# Altium project ife18_TS_BMS_Master_STM32.PrjPcb
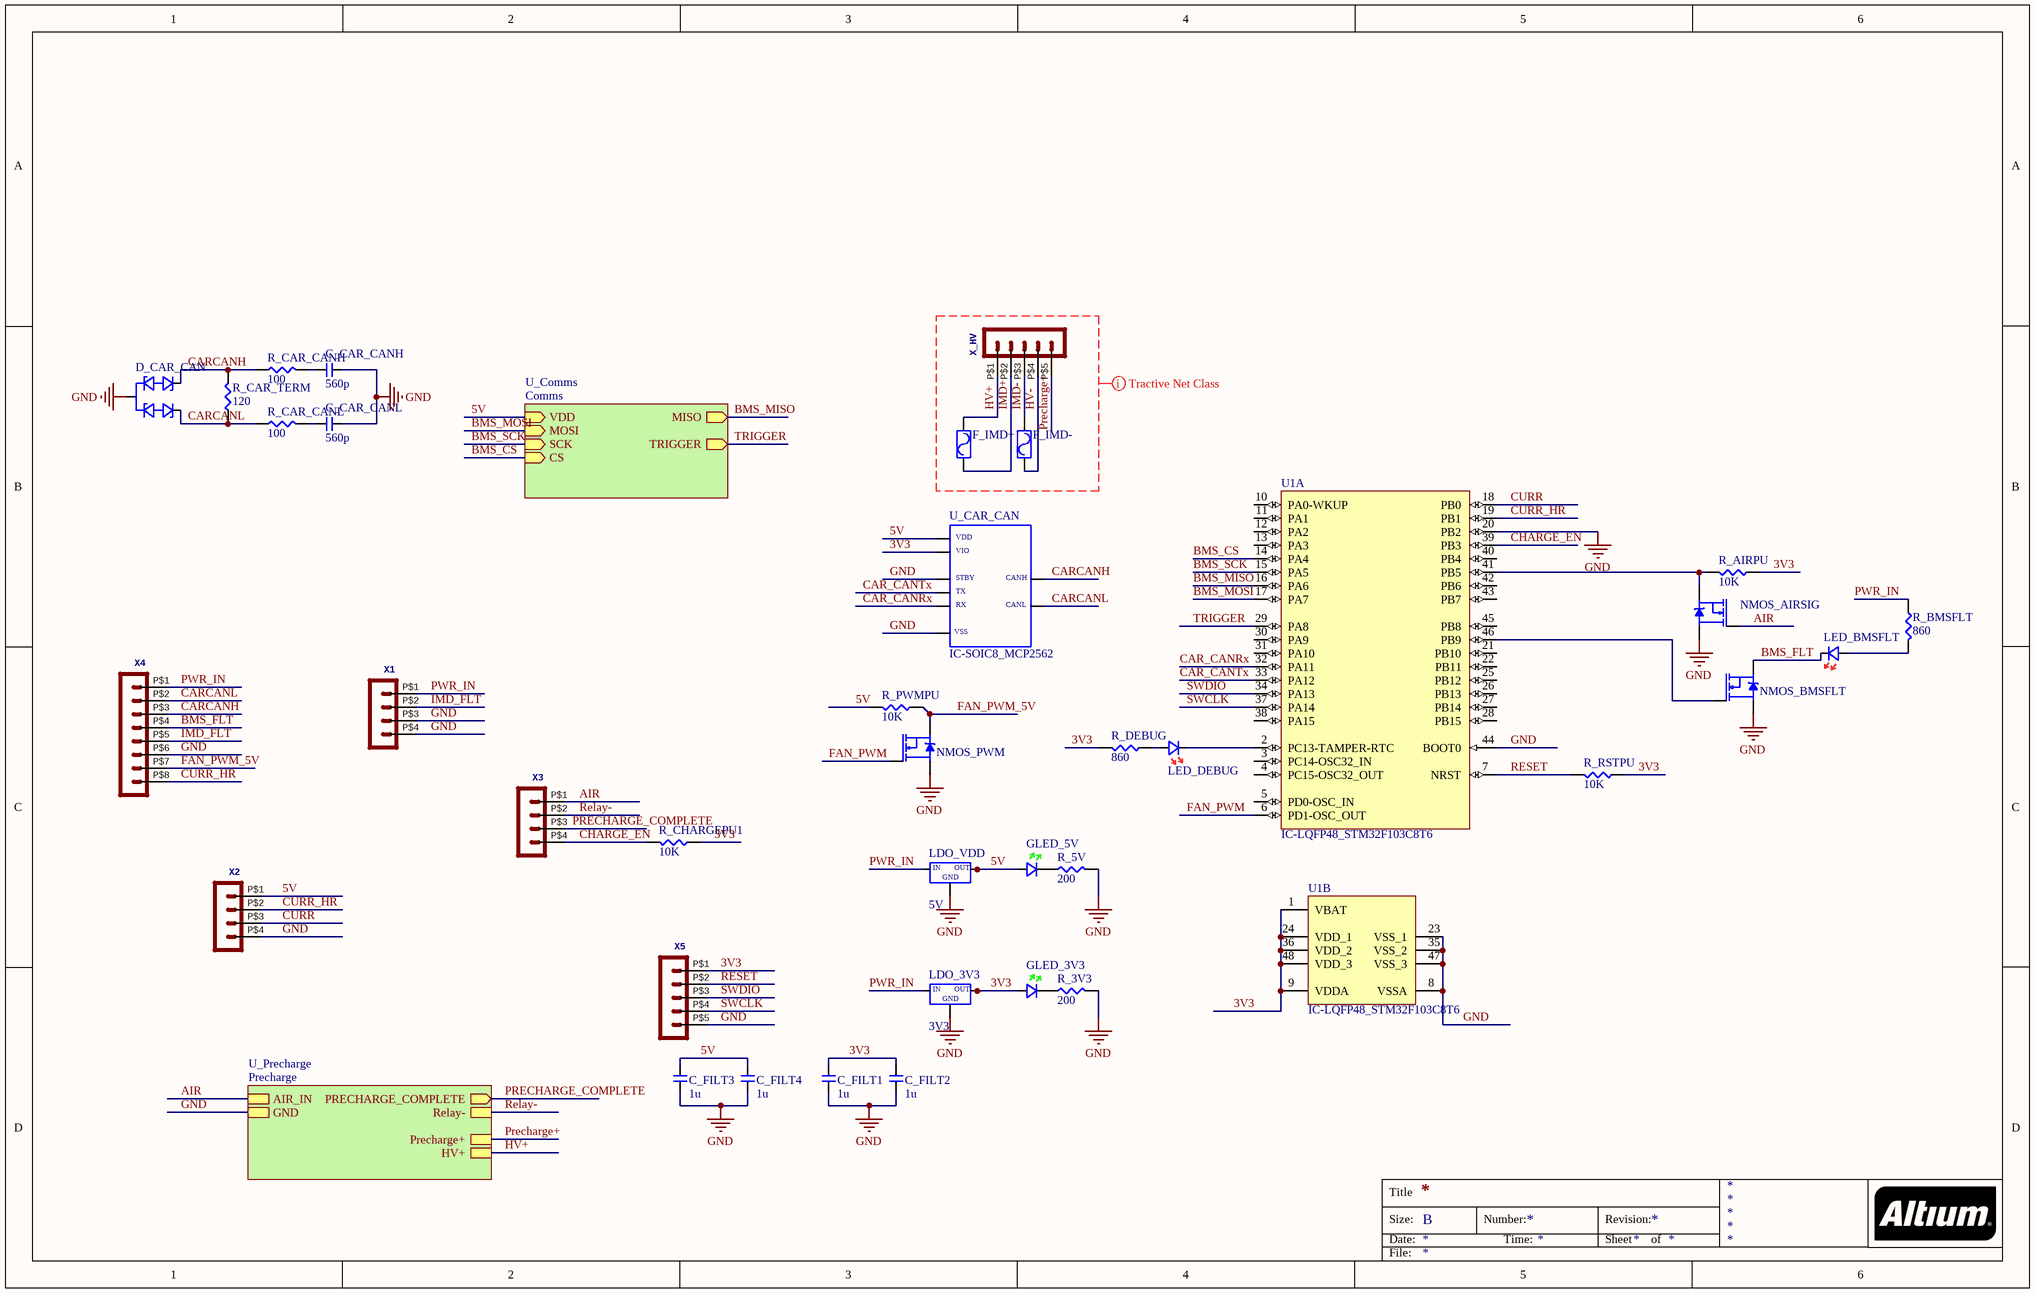
[diagram p0: ife18_TS_BMS_Master.SchDoc]
2 sheets, 48 parts. Net scope: hierarchical (ports join the sheet entries above them; power ports are global).
Board file: ife18_TS_BMS_Master_STM32.PcbDoc
Sheets:
  ife18_TS_BMS_Master.SchDoc
    U_Comms = Comms.SchDoc

## Sheet ife18_TS_BMS_Master.SchDoc
size B

### Parts
C_CAR_CANH  560p  [CAP-0603]
C_CAR_CANL  560p  [CAP-0603]
C_FILT1  1u  [CAP-0603]
C_FILT2  1u  [CAP-0603]
C_FILT3  1u  [CAP-0603]
C_FILT4  1u  [CAP-0603]
D_CAR_CAN  DIODE-SOT23_PESD1CAN  [SOT23]  (value not drawn)
F_IMD+  FUSE_885  [FUSE_885]  (value not drawn)
F_IMD-  FUSE_885  [FUSE_885]  (value not drawn)
GLED_3V3  (no value)  [LEDGREEN-0603]
GLED_5V  (no value)  [LEDGREEN-0603]
LDO_3V3  3V3  [SOT223]
LDO_VDD  5V  [SOT223]
LED_BMSFLT  LEDRED-0603  [LEDRED-0603]  (value not drawn)
LED_DEBUG  LEDRED-0603  [LEDRED-0603]  (value not drawn)
NMOS_AIRSIG  NMOS-SOT23  [SOT23]  (value not drawn)
NMOS_BMSFLT  NMOS-SOT23  [SOT23]  (value not drawn)
NMOS_PWM  NMOS-SOT23  [SOT23]  (value not drawn)
R_3V3  200  [RES-0603]
R_5V  200  [RES-0603]
R_AIRPU  10K  [RES-0603]
R_BMSFLT  860  [RES-0603]
R_CAR_CANH  100  [RES-0603]
R_CAR_CANL  100  [RES-0603]
R_CAR_TERM  120  [RES-0603]
R_CHARGEPU1  10K  [RES-0603]
R_DEBUG  860  [RES-0603]
R_PWMPU  10K  [RES-0603]
R_RSTPU  10K  [RES-0603]
U1  IC-LQFP48_STM32F103C8T6  [STM-LQFP48_M]  (parts A,B of 2)
U_CAR_CAN  IC-SOIC8_MCP2562  [SOIC8]
X1  Molex - Micro-Fit 3.0 Series connector,  3.00mm (0.118") pitch header, 4 positions.  [43650-0424]  (value not drawn)
X2  Molex - Micro-Fit 3.0 Series connector,  3.00mm (0.118") pitch header, 4 positions.  [43650-0424]  (value not drawn)
X3  Molex - Micro-Fit 3.0 Series connector,  3.00mm (0.118") pitch header, 4 positions.  [43650-0424]  (value not drawn)
X4  Molex - Micro-Fit 3.0 Series connector,  3.00mm (0.118") pitch header, 8 positions.  [43650-0824]  (value not drawn)
X5  (no value)  [POS5_254MM_MALE]
X_HV  Molex - Micro-Fit 3.0 Series connector,  3.00mm (0.118") pitch header, 5 positions.  [43650-0524]  (value not drawn)

### Sub-sheets
U_Comms = Comms: VDD (in), MOSI (in), MISO (out), SCK (in), CS (in), TRIGGER (out)
U_Precharge = Precharge (file not in this document): PRECHARGE_COMPLETE (out), AIR_IN, GND, Precharge+, HV+, Relay-

### Nets
GND: C_CAR_CANH.2 C_CAR_CANL.2 C_FILT1.1 C_FILT2.1 C_FILT3.1 C_FILT4.1 D_CAR_CAN.3(G) LDO_3V3.1 LDO_VDD.1 NMOS_AIRSIG.2(S) NMOS_BMSFLT.2(S) NMOS_PWM.2(S) R_3V3.2 R_5V.2 U1.8(VSSA) U1.20(PB2) U1.23(VSS_1) U1.35(VSS_2) U1.44(BOOT0) U1.47(VSS_3) U_CAR_CAN.2 U_CAR_CAN.8 X1.P$3 X1.P$4 X2.P$4 X4.P$6 X5.P$5 ; sheet U_Precharge/GND
3V3: C_FILT1.2 C_FILT2.2 GLED_3V3.A LDO_3V3.2 LDO_3V3.4 R_AIRPU.1 R_CHARGEPU1.1 R_DEBUG.2 R_RSTPU.1 U1.1(VBAT) U1.9(VDDA) U1.24(VDD_1) U1.36(VDD_2) U1.48(VDD_3) U_CAR_CAN.5 X5.P$1
5V: C_FILT3.2 C_FILT4.2 GLED_5V.A LDO_VDD.2 LDO_VDD.4 R_PWMPU.1 U_CAR_CAN.3 X2.P$1 ; sheet U_Comms/VDD
AIR: NMOS_AIRSIG.1(G) X3.P$1 ; sheet U_Precharge/AIR_IN
BMS_CS: U1.14(PA4) ; sheet U_Comms/CS
BMS_FLT: LED_BMSFLT.K NMOS_BMSFLT.3(D) X4.P$4
BMS_MISO: U1.16(PA6) ; sheet U_Comms/MISO
BMS_MOSI: U1.17(PA7) ; sheet U_Comms/MOSI
BMS_SCK: U1.15(PA5) ; sheet U_Comms/SCK
CAR_CANRx: U1.32(PA11) U_CAR_CAN.4
CAR_CANTx: U1.33(PA12) U_CAR_CAN.1
CARCANH: D_CAR_CAN.2(CAN2) R_CAR_CANH.1 R_CAR_TERM.2 U_CAR_CAN.7 X4.P$3
CARCANL: D_CAR_CAN.1(CAN1) R_CAR_CANL.1 R_CAR_TERM.1 U_CAR_CAN.6 X4.P$2
CHARGE_EN: R_CHARGEPU1.2 U1.39(PB3) X3.P$4
CURR: U1.18(PB0) X2.P$3
CURR_HR: U1.19(PB1) X2.P$2 X4.P$8
FAN_PWM: NMOS_PWM.1(G) U1.6(PD1-OSC_OUT)
FAN_PWM_5V: NMOS_PWM.3(D) R_PWMPU.2 X4.P$7
HV+: F_IMD+.1 X_HV.P$1 ; sheet U_Precharge/HV+
HV-: F_IMD-.2 X_HV.P$4
IMD+: F_IMD+.2 X_HV.P$2
IMD-: F_IMD-.1 X_HV.P$3
IMD_FLT: X1.P$2 X4.P$5
Precharge+: X_HV.P$5 ; sheet U_Precharge/Precharge+
PRECHARGE_COMPLETE: X3.P$3 ; sheet U_Precharge/PRECHARGE_COMPLETE
PWR_IN: LDO_3V3.3 LDO_VDD.3 R_BMSFLT.2 X1.P$1 X4.P$1
Relay-: X3.P$2 ; sheet U_Precharge/Relay-
RESET: R_RSTPU.2 U1.7(NRST) X5.P$2
SWCLK: U1.37(PA14) X5.P$4
SWDIO: U1.34(PA13) X5.P$3
TRIGGER: U1.29(PA8) ; sheet U_Comms/TRIGGER
NetC_CAR_CANH_1: C_CAR_CANH.1 R_CAR_CANH.2
NetC_CAR_CANL_1: C_CAR_CANL.1 R_CAR_CANL.2
NetGLED_3V3_K: GLED_3V3.K R_3V3.1
NetGLED_5V_K: GLED_5V.K R_5V.1
NetLED_BMSFLT_A: LED_BMSFLT.A R_BMSFLT.1
NetLED_DEBUG_A: LED_DEBUG.A R_DEBUG.1
NetLED_DEBUG_K: LED_DEBUG.K U1.2(PC13-TAMPER-RTC)
NetNMOS_AIRSIG_3: NMOS_AIRSIG.3(D) R_AIRPU.2 U1.41(PB5)
NetNMOS_BMSFLT_1: NMOS_BMSFLT.1(G) U1.46(PB9)

Not connected (* = marked no-connect by the designer): U1 3(PC14-OSC32_IN) 4(PC15-OSC32_OUT) 5(PD0-OSC_IN) 10(PA0-WKUP) 11(PA1) 12(PA2) 13(PA3) 21(PB10) 22(PB11) 25(PB12) 26(PB13) 27(PB14) 28(PB15) 30(PA9) 31(PA10) 38(PA15) 40(PB4) 42(PB6) 43(PB7) 45(PB8)

### Layout directives
net class Tractive: HV+, HV-, IMD+, IMD-, Precharge+

### Notes on the sheet
- Title
- Size:
- Date:
- B
- Number:
- Time:
- Revision:
- Sheet
- of
- File:
- (in symbol IC-SOIC8_MCP2562) VDD; VIO; STBY; CANH; TX; RX; CANL; VSS
- (in symbol LDO-SOT223_SPX1117) IN; OUT; GND

### Library data of the parts
C_CAR_CANH C_CAR_CANL C_FILT1-C_FILT4 = CAP-0603
GLED_3V3 GLED_5V = LEDGREEN-0603
LDO_3V3 LDO_VDD = LDO-SOT223_SPX1117
R_3V3 R_5V R_AIRPU R_BMSFLT R_CAR_CANH R_CAR_CANL R_CAR_TERM R_CHARGEPU1 R_DEBUG R_PWMPU R_RSTPU = RES-0603
U1 = IC-LQFP48_STM32F103C8T6: A/D Converter: 2x12-bit (10 Channel); Core: ARM Cortex-M3; FLASH Size (Prog) (kB): 64; I/Os (High Current): 37; Internal RAM Size (kB): 20; Operating Frequency(F) (Processor speed) (MHz): 72; Packing: Tray; Supply Voltage(Vcc) min (V): 2; DatasheetVersion: Rev. 16; PackageVersion: Rev. 6, 06/2013; PackageReference: LQFP48; PackageDescription: 48-Pin Low Profile Quad Flat Package, 7 x 7 mm Body, 0.5 mm Pitch; Supplier 1: Digi-Key; Supplier Part Number 1: 497-6063-ND; Supplier 2: Farnell; Supplier Part Number 2: 1447637; Supplier 3: Newark; Supplier Part Number 3: 59M2182; Supplier 4: Newark; Supplier Part Number 4: 57P1222; Supplier 5: Mouser; Supplier Part Number 5: 511-STM32F103C8T6; Mounting Technology: Surface Mount; PartNumber: STM32F103C8T6; ComponentLink1Description: Manufacturer URL; ComponentLink1URL: http://www.st.com/web/en/home.html; ComponentLink2Description: Datasheet; ComponentLink2URL: http://www.st.com/st-web-ui/static/active/en/resource/technical/document/datasheet/CD00161566.pdf; ComponentLink3Description: Package Specification; ComponentLink3URL: http://www.st.com/st-web-ui/static/active/en/resource/technical/document/datasheet/DM00058181.pdf
X1-X3 = POS4_MF43650-0424: GateName_1: G$1; SymbolName_1: HEADER_POS4; DeviceSetName: HEADER_POS4_?; DeviceName: 43650-0424; LibraryName: MOLEX Micro-Fit; Package: 43650-0424
X4 = HEADER_POS8_?43650-0824: GateName_1: G$1; SymbolName_1: HEADER_POS8; DeviceName: 43650-0824; LibraryName: MOLEX Micro-Fit; DeviceSetName: HEADER_POS8_?; Package: 43650-0824
X5 = POS5_254MM_MALE: GateName_1: G$1; SymbolName_1: HEADER_POS5; DeviceName: 43650-0524; DeviceSetName: HEADER_POS5_?; LibraryName: MOLEX Micro-Fit; Package: 43650-0524
X_HV = POS5_MF43650-0524: GateName_1: G$1; SymbolName_1: HEADER_POS5; DeviceSetName: HEADER_POS5_?; DeviceName: 43650-0524; LibraryName: MOLEX Micro-Fit; Package: 43650-0524

## Sheet Comms.SchDoc
size A
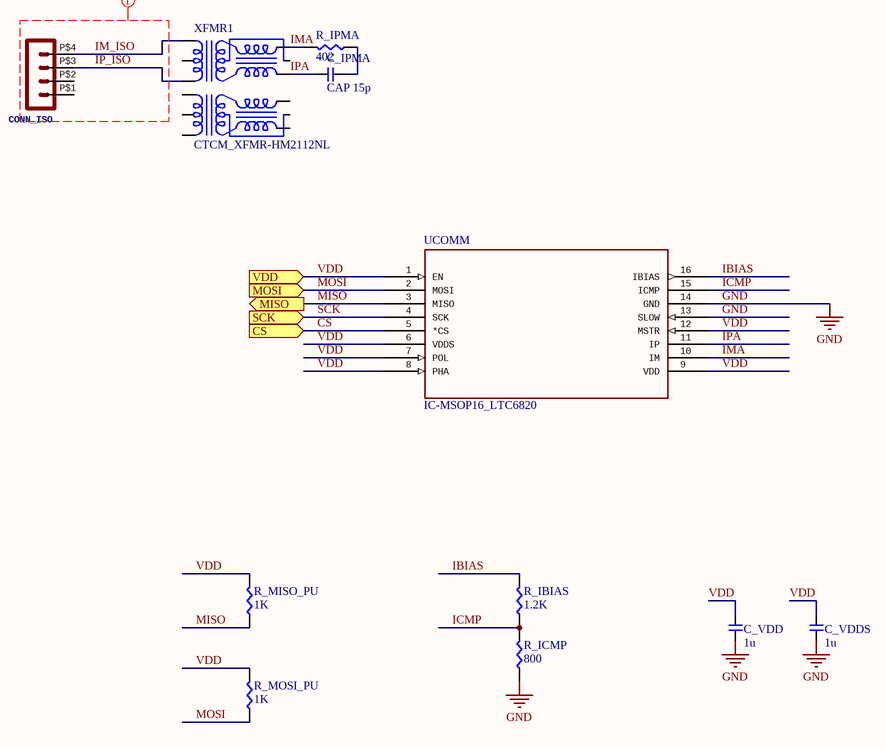
[diagram p1: Comms.SchDoc]

### Parts
C_IPMA  CAP 15p  [CAP-0603]
C_VDD  1u  [CAP-0603]
C_VDDS  1u  [CAP-0603]
CONN_ISO  Molex - Micro-Fit 3.0 Series connector,  3.00mm (0.118") pitch header, 4 positions.  [43650-0424]  (value not drawn)
R_IBIAS  1.2K  [RES-0603]
R_ICMP  800  [RES-0603]
R_IPMA  402  [RES-0603]
R_MISO_PU  1K  [RES-0603]
R_MOSI_PU  1K  [RES-0603]
UCOMM  IC-MSOP16_LTC6820  [MSOP16]
XFMR1  CTCM_XFMR-HM2112NL  [HM2112NL]

### Ports
CS (in), MISO (out), MOSI (in), SCK (in), VDD (in)

### Nets
GND: C_VDD.1 C_VDDS.1 R_ICMP.1 UCOMM.13(SLOW) UCOMM.14(GND)
CS: UCOMM.5(*CS) ; port CS  [project net BMS_CS]
IBIAS: R_IBIAS.2 UCOMM.16(IBIAS)
ICMP: R_IBIAS.1 R_ICMP.2 UCOMM.15(ICMP)
IM_ISO: CONN_ISO.P$4 XFMR1.1
IMA: R_IPMA.1 UCOMM.10(IM) XFMR1.12
IP_ISO: CONN_ISO.P$3 XFMR1.3
IPA: C_IPMA.1 UCOMM.11(IP) XFMR1.10
MISO: R_MISO_PU.1 UCOMM.3(MISO) ; port MISO  [project net BMS_MISO]
MOSI: R_MOSI_PU.1 UCOMM.2(MOSI) ; port MOSI  [project net BMS_MOSI]
SCK: UCOMM.4(SCK) ; port SCK  [project net BMS_SCK]
VDD: C_VDD.2 C_VDDS.2 R_MISO_PU.2 R_MOSI_PU.2 UCOMM.1(EN) UCOMM.6(VDDS) UCOMM.7(POL) UCOMM.8(PHA) UCOMM.9(VDD) UCOMM.12(MSTR) ; port VDD  [project net 5V]
NetC_IPMA_2: C_IPMA.2 R_IPMA.2

Not connected (* = marked no-connect by the designer): CONN_ISO P$1(1) P$2(2); XFMR1 2 4 5 6 7 8 9 11

### Layout directives
net class Tractive: IM_ISO, IP_ISO

### Library data of the parts
C_IPMA C_VDD C_VDDS = CAP-0603
CONN_ISO = POS4_MF43650-0424: as X1 on sheet ife18_TS_BMS_Master; DeviceName: 43650-0424; LibraryName: MOLEX Micro-Fit; Package: 43650-0424
R_IBIAS R_ICMP R_IPMA R_MISO_PU R_MOSI_PU = RES-0603

## Nets that join several sheets
GND: ife18_TS_BMS_Master (27 pins), Comms (5 pins)
5V: ife18_TS_BMS_Master (8 pins), Comms (10 pins)
BMS_CS: ife18_TS_BMS_Master (U1.14), Comms (UCOMM.5)
BMS_MISO: ife18_TS_BMS_Master (U1.16), Comms (R_MISO_PU.1 UCOMM.3)
BMS_MOSI: ife18_TS_BMS_Master (U1.17), Comms (R_MOSI_PU.1 UCOMM.2)
BMS_SCK: ife18_TS_BMS_Master (U1.15), Comms (UCOMM.4)